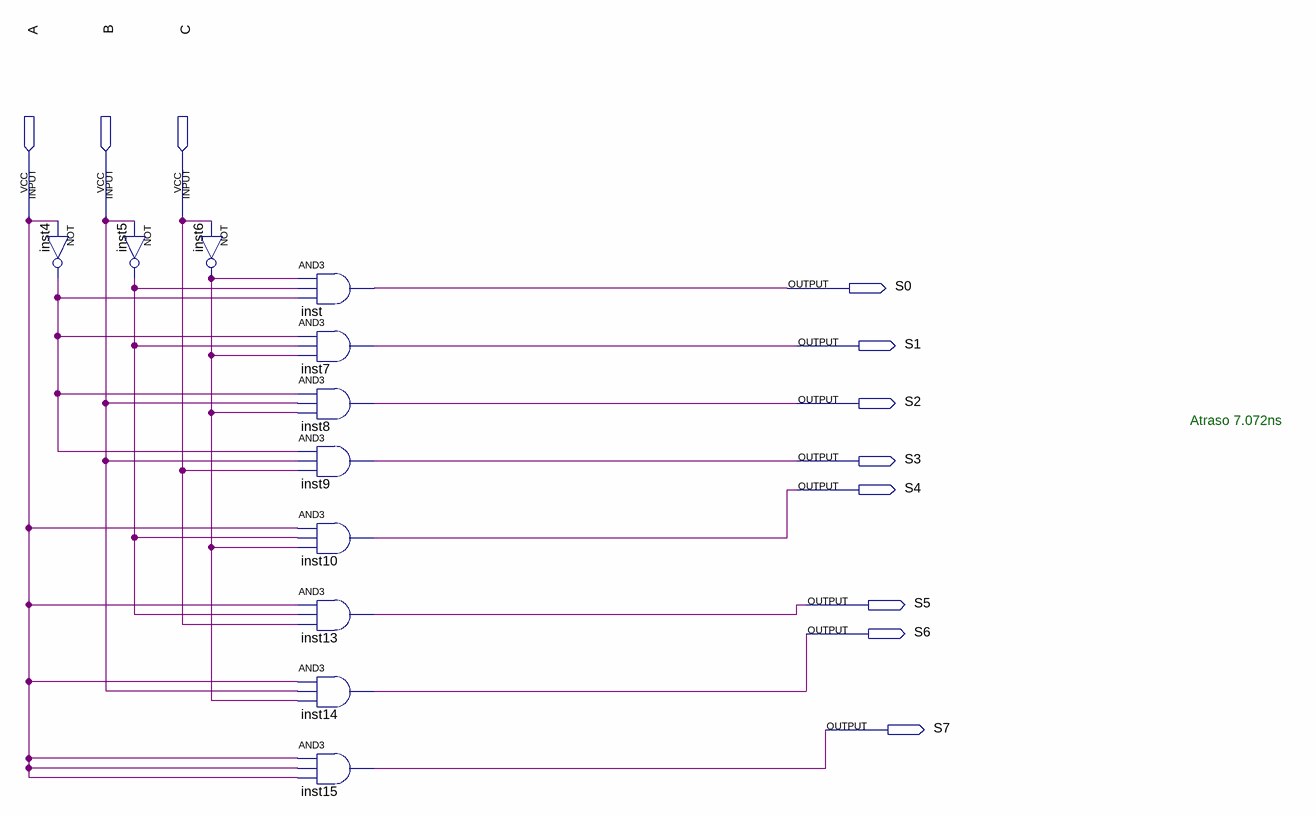
[diagram p0: schematic sheet]
// Quartus schematic DECODER3_8.bdf as structural Verilog: 11 symbols, 11 pins
module DECODER3_8 (
  input  A,
  input  B,
  input  C,
  output S0,
  output S1,
  output S2,
  output S3,
  output S4,
  output S5,
  output S6,
  output S7
);

  wire inst4_out, inst5_out, inst6_out;

  not inst4 (inst4_out, A);
  not inst5 (inst5_out, B);
  not inst6 (inst6_out, C);
  and inst (S0, inst6_out, inst5_out, inst4_out);
  and inst7 (S1, inst4_out, inst5_out, inst6_out);
  and inst8 (S2, inst4_out, B, inst6_out);
  and inst9 (S3, inst4_out, B, C);
  and inst10 (S4, A, inst5_out, inst6_out);
  and inst13 (S5, A, inst5_out, C);
  and inst14 (S6, A, B, inst6_out);
  and inst15 (S7, A, A, A);

  // Notes on the sheet:
  //   Atraso 7.072ns
endmodule
